# Altium schematic sheet Connectors.SchDoc
size A
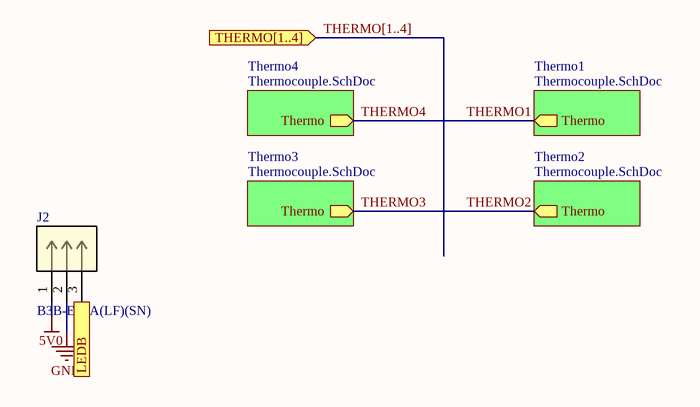
[diagram p0: Connectors.SchDoc]

## Parts
J2  B3B-EH-A(LF)(SN)  [CONN3_B3B-EH-A(LF)(SN)_JST]

## Sub-sheets
Thermo1 = Thermocouple.SchDoc: Thermo (out)
Thermo2 = Thermocouple.SchDoc: Thermo (out)
Thermo3 = Thermocouple.SchDoc: Thermo (out)
Thermo4 = Thermocouple.SchDoc: Thermo (out)

## Ports
LEDB (in), THERMO[1..4] (in)

## Nets
5V0: J2.1
GND: J2.2
LEDB: J2.3 ; port LEDB
THERMO1: sheet Thermo1/Thermo, sheet Thermo4/Thermo  [also labelled THERMO4]
THERMO2: sheet Thermo2/Thermo, sheet Thermo3/Thermo  [also labelled THERMO3]

## Buses and harness runs
bus THERMO[1..4] = port THERMO[1..4]

## Library data of the parts
J2 = B3B-EH-A(LF)(SN): No Description Available; Vendor: JST; Built_By: EMA_Kyle; SourceLibrary: JST_2020-07-31; Datasheet: http://www.jst-mfg.com/product/pdf/eng/eEH.pdf; Manufacturer_Part_Number: B3B-EH-A(LF)(SN); Copyright: Copyright (C) 2018 Accelerated Designs. All rights reserved; RefDes: RefDes; Type: DEV